# EAGLE design ESP32-S3 Parallel TFT with Touch 4.3“ V1.1 (EAGLE 6.1)
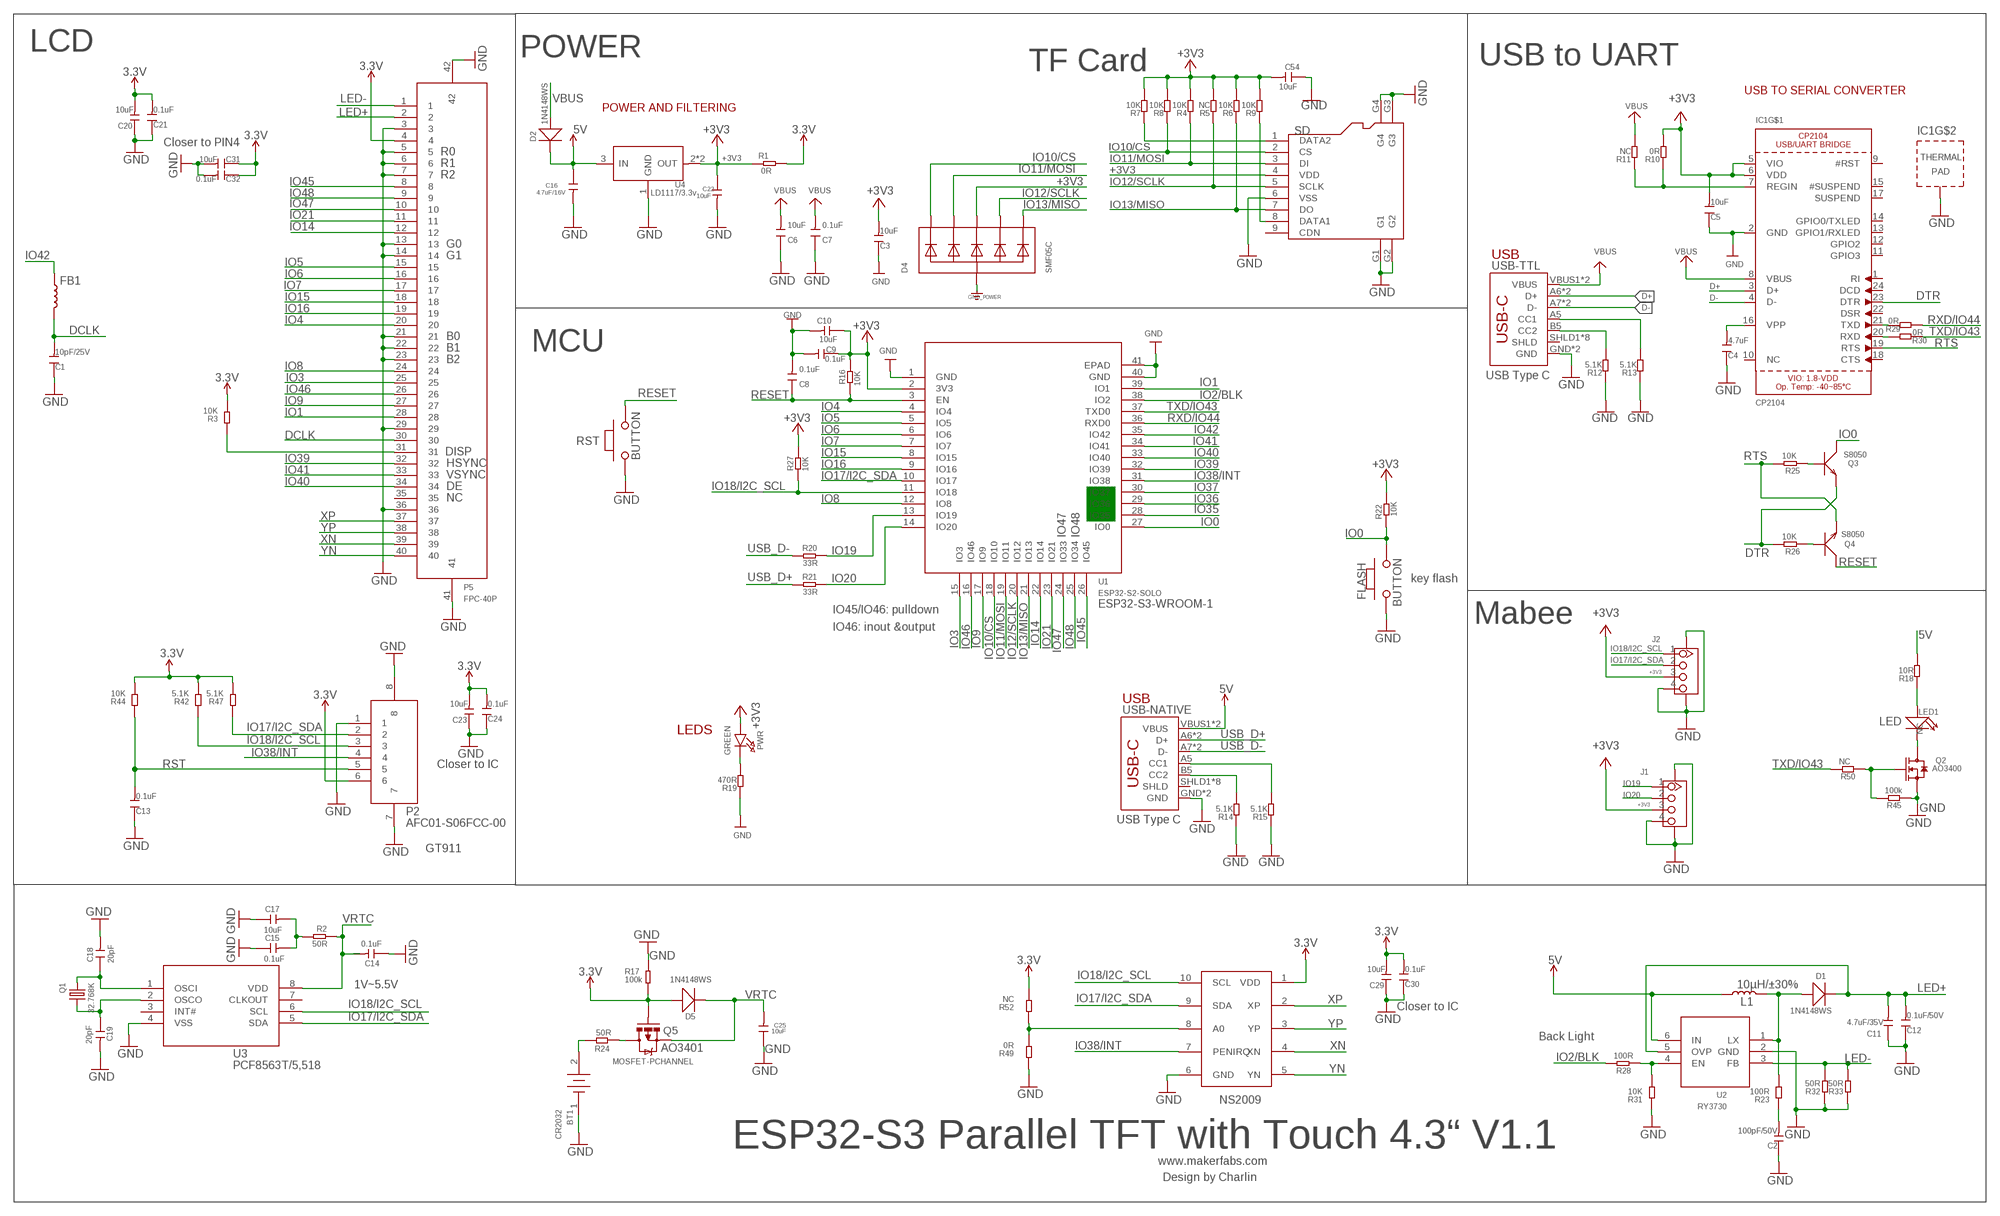
[diagram p0: schematic, sheet 1]

## Parts
BT1  CR2032  [CR2032]
C1  10pF/25V  DISCRETE_C-0603  [DISCRETE_C0603]
C2  100pF/50V  DISCRETE_C-0603  [DISCRETE_C0603]
C3  10uF  DISCRETE_C-0603  [DISCRETE_C0603]
C4  4.7uF  DISCRETE_C-0603  [DISCRETE_C0603]
C5  10uF  DISCRETE_C-0603  [DISCRETE_C0603]
C6  10uF  DISCRETE_C-0603  [DISCRETE_C0603]
C7  0.1uF  DISCRETE_C-0603  [DISCRETE_C0603]
C8  0.1uF  DISCRETE_C-0603  [DISCRETE_C0603]
C9  0.1uF  DISCRETE_C-0603  [DISCRETE_C0603]
C10  10uF  DISCRETE_C-0603  [DISCRETE_C0603]
C11  4.7uF/35V  DISCRETE_C-1206  [DISCRETE_C1206]
C12  0.1uF/50V  DISCRETE_C-0603  [DISCRETE_C0603]
C13  0.1uF  DISCRETE_C-0603  [DISCRETE_C0603]
C14  0.1uF  DISCRETE_C-0603  [DISCRETE_C0603]
C15  0.1uF  DISCRETE_C-0603  [DISCRETE_C0603]
C16  4.7uF/16V  C-0603  [0603]
C17  10uF  DISCRETE_C-0603  [DISCRETE_C0603]
C18  20pF  DISCRETE_C-0603  [DISCRETE_C0603]
C19  20pF  DISCRETE_C-0603  [DISCRETE_C0603]
C20  10uF  DISCRETE_C-0603  [DISCRETE_C0603]
C21  0.1uF  DISCRETE_C-0603  [DISCRETE_C0603]
C22  10uF  C-0603  [0603]
C23  10uF  DISCRETE_C-0603  [DISCRETE_C0603]
C24  0.1uF  DISCRETE_C-0603  [DISCRETE_C0603]
C25  10uF  C-0603  [0603]
C29  10uF  DISCRETE_C-0603  [DISCRETE_C0603]
C30  0.1uF  DISCRETE_C-0603  [DISCRETE_C0603]
C31  10uF  DISCRETE_C-0603  [DISCRETE_C0603]
C32  0.1uF  DISCRETE_C-0603  [DISCRETE_C0603]
C54  10uF  DISCRETE_C-0603  [DISCRETE_C0603]
D1  1N4148WS  D'0805'  [SOD323]
D2  1N4148WS  D'0805'  [SOD323]
D4  SMF05C  TVSARRAY_5LANE  [SOT363]
D5  1N4148WS  D'0805'  [SOD323]
FB1  INDUCTORFB-30OHM  [0603]
FLASH  BUTTON  PB157  [157SW]
IC1  CP2104  [QFN24_4MM_SMSC]
J1  GROVE-CONNECTOR-SMD'90D'  [HW4-SMD-2.0-90D]
J2  GROVE-CONNECTOR-SMD'90D'  [HW4-SMD-2.0-90D]
L1  10µH/±30%  INDUCTOR-CR54-3.3UH  [CR54]
LED1  NC  DISCRETE_LED3528  [DISCRETE_LED-3528]
P2  AFC01-S06FCC-00  [SMD8-50P-740L535W]
P5  FPC-40P  [SMD42-50P-2560L490W]
PWR  GREEN  LED0805_NOOUTLINE  [CHIPLED_0805_NOOUTLINE]
Q1  32.768K  CRYSTAL_3215  [XTAL3215]
Q2  AO3400  MOSFET-N'SOT23'  [SOT23@1]
Q3  S8050  TRANSISTOR-NPN-SOT23  [SOT23]
Q4  S8050  TRANSISTOR-NPN-SOT23  [SOT23]
Q5  MOSFET-PCHANNEL  [SOT23-3]
R1  0R  R-0603  [R0603]
R2  50R  R-0603  [R0603]
R3  10K  DISCRETE_R-0603  [DISCRETE_R0603]
R4  10K  DISCRETE_R-0603  [DISCRETE_R0603]
R5  NC  DISCRETE_R-0603  [DISCRETE_R0603]
R6  10K  DISCRETE_R-0603  [DISCRETE_R0603]
R7  10K  DISCRETE_R-0603  [DISCRETE_R0603]
R8  10K  DISCRETE_R-0603  [DISCRETE_R0603]
R9  10K  DISCRETE_R-0603  [DISCRETE_R0603]
R10  0R  DISCRETE_R-0603  [DISCRETE_R0603]
R11  NC  DISCRETE_R-0603  [DISCRETE_R0603]
R12  5.1K  DISCRETE_R-0603  [DISCRETE_R0603]
R13  5.1K  DISCRETE_R-0603  [DISCRETE_R0603]
R14  5.1K  DISCRETE_R-0603  [DISCRETE_R0603]
R15  5.1K  DISCRETE_R-0603  [DISCRETE_R0603]
R16  10K  R-0603  [R0603]
R17  100k  R-0603  [R0603]
R18  10R  DISCRETE_R-0603  [DISCRETE_R0603]
R19  470R  DISCRETE_R-0603  [DISCRETE_R0603]
R20  33R  R-0603  [R0603]
R21  33R  R-0603  [R0603]
R22  10K  R-0603  [R0603]
R23  100R  DISCRETE_R-0603  [DISCRETE_R0603]
R24  50R  R-0603  [R0603]
R25  10K  R-0603  [R0603]
R26  10K  R-0603  [R0603]
R27  10K  R-0603  [R0603]
R28  100R  DISCRETE_R-0603  [DISCRETE_R0603]
R29  0R  R-0603  [R0603]
R30  0R  R-0603  [R0603]
R31  10K  DISCRETE_R-0603  [DISCRETE_R0603]
R32  50R  DISCRETE_R-0603  [DISCRETE_R0603]
R33  50R  DISCRETE_R-0603  [DISCRETE_R0603]
R42  5.1K  DISCRETE_R-0603  [DISCRETE_R0603]
R44  10K  DISCRETE_R-0603  [DISCRETE_R0603]
R45  100k  R-0603  [R0603]
R47  5.1K  DISCRETE_R-0603  [DISCRETE_R0603]
R49  0R  DISCRETE_R-0603  [DISCRETE_R0603]
R50  NC  R-0603  [R0603]
R52  NC  DISCRETE_R-0603  [DISCRETE_R0603]
RST  BUTTON  PB157  [157SW]
SD  HOLDER-MICROSD-9P  [9P-SMD-W/-RING]
U1  ESP32­S2­SOLO  [ESP32-­S2-­SOLO]
U2  RY3730  [SOT23-6]
U3  PCF8563T/5,518  [SOP8]
U4  LD1117/3.3v  LD1117'SOT89'  [SOT89]
U8  NS2009  [MSOP10]
USB-NATIVE  USB_C5  [USB-C-16P-5]
USB-TTL  USB_C5  [USB-C-16P-5]

## Nets
3.3V: C20.2 C21.2 C23.2 C24.2 C29.2 C30.2 C31.1 C32.1 D5.+ P2.6 P5.4 Q5.1(G) R1.2 R3.2 R17.1 R42.2 R44.2 R47.2 R52.2 U8.1(VDD)
5V: C16.1 D2.- L1.P$1 R18.2 U2.6(IN) U4.3(IN) USB-NATIVE.VBUS1(VBUS) USB-NATIVE.VBUS2(VBUS)
+3V3: C3.2 C5.2 C9.1 C10.1 C22.1 C54.2 D4.4(C3) IC1.5(VIO) IC1.6(VDD) J1.3 J2.3 PWR.A R1.1 R4.2 R5.2 R6.2 R7.2 R8.2 R9.2 R10.2 R16.2 R22.2 R27.2 SD.4(VDD) U1.2(3V3) U4.2(OUT) U4.4(OUT)
D+: IC1.3(D+) USB-TTL.A6(D+) USB-TTL.B6(D+)
D-: IC1.4(D-) USB-TTL.A7(D-) USB-TTL.B7(D-)
DCLK: C1.2 FB1.2 P5.30
DTR: IC1.23(DTR) Q3.2(E) R26.2
GND: BT1.1 C1.1 C2.1 C3.1 C4.1 C5.1 C6.1 C7.1 C8.2 C9.2 C10.2 C11.1 C12.1 C13.1 C14.1 C15.1 C16.2 C17.1 C18.2 C19.2 C20.1 C21.1 C22.2 C23.1 C24.1 C25.1 C29.1 C30.1 C31.2 C32.2 C54.1 D4.2(A) FLASH.1 IC1.2(GND) IC1.THERM(TP) J1.4 J1.SS1 J1.SS2 J2.4 J2.SS1 J2.SS2 P2.1 P2.7 P2.8 P5.3 P5.5 P5.6 P5.7 P5.13 P5.14 P5.21 P5.22 P5.23 P5.29 P5.36 P5.41 P5.42 Q2.2(S) R12.1 R13.1 R14.1 R15.1 R17.2 R19.1 R31.1 R32.1 R33.1 R45.1 R49.1 RST.1 SD.6(VSS) SD.G1 SD.G2 SD.G3 SD.G4 U1.1(GND) U1.40(GND) U1.41(EPAD) U2.2(GND) U3.4(VSS) U4.1(GND) U8.6(GND) USB-NATIVE.GND USB-NATIVE.GND2(GND) USB-TTL.GND USB-TTL.GND2(GND) ; supply symbol labelled GND_POWER
IO0: FLASH.2 Q3.3(C) R22.1 U1.27(IO0)
IO1: P5.28 U1.39(IO1)
IO2/BLK: R28.2 U1.38(IO2)
IO3: P5.25 U1.15(IO3)
IO4: P5.20 U1.4(IO4)
IO5: P5.15 U1.5(IO5)
IO6: P5.16 U1.6(IO6)
IO7: P5.17 U1.7(IO7)
IO8: P5.24 U1.12(IO8)
IO9: P5.27 U1.17(IO9)
IO10/CS: D4.1(C1) R8.1 SD.2(CS) U1.18(IO10)
IO11/MOSI: D4.3(C2) R4.1 SD.3(DI) U1.19(IO11)
IO12/SCLK: D4.5(C4) R5.1 SD.5(SCLK) U1.20(IO12)
IO13/MISO: D4.6(C5) R6.1 SD.7(DO) U1.21(IO13)
IO14: P5.12 U1.22(IO14)
IO15: P5.18 U1.8(IO15)
IO16: P5.19 U1.9(IO16)
IO17/I2C_SDA: J2.2 P2.2 R47.1 U1.10(IO17) U3.5(SDA) U8.9(SDA)
IO18/I2C_SCL: J2.1 P2.3 R27.1 R42.1 U1.11(IO18) U3.6(SCL) U8.10(SCL)
IO19: J1.1 R20.2 U1.13(IO19)
IO20: J1.2 R21.2 U1.14(IO20)
IO21: P5.11 U1.23(IO21)
IO35: U1.28(IO35)
IO36: U1.29(IO36)
IO37: U1.30(IO37)
IO38/INT: P2.4 U1.31(IO38) U8.7(PENIRQ)
IO39: P5.32 U1.32(IO39)
IO40: P5.34 U1.33(IO40)
IO41: P5.33 U1.34(IO41)
IO42: FB1.1 U1.35(IO42)
IO45: P5.8 U1.26(IO45)
IO46: P5.26 U1.16(IO46)
IO47: P5.10 U1.24(IO33)
IO48: P5.9 U1.25(IO34)
LED+: C11.2 C12.2 D1.- P5.2 U2.5(OVP)
LED-: P5.1 R32.2 R33.2 U2.3(FB)
N$1: C4.2 IC1.16(VPP)
N$2: Q4.1(B) R26.1
N$3: Q3.1(B) R25.1
N$4: C18.1 Q1.P$1 U3.1(OSCI)
N$5: Q2.1(G) R45.2 R50.1
N$6: R15.2 USB-NATIVE.A5(CC1)
N$7: PWR.C R19.2
N$8: LED1.1(+) R18.1
N$9: LED1.2(-) Q2.3(D)
N$10: R13.2 USB-TTL.A5(CC1)
N$11: R12.2 USB-TTL.B5(CC2)
N$12: IC1.7(REGIN) R10.1 R11.1
N$13: C19.1 Q1.P$2 U3.2(OSCO)
N$14: R14.2 USB-NATIVE.B5(CC2)
N$15: Q5.3(D) R24.1
N$16: C15.2 C17.2 R2.1
N$17: D1.+ L1.P$2 R23.2 U2.1(LX)
N$18: IC1.21(TXD) R29.2
N$19: IC1.20(RXD) R30.2
N$20: BT1.2 R24.2
N$22: C2.2 R23.1
N$24: R28.1 R31.2 U2.4(EN)
N$25: R49.2 R52.1 U8.8(A0)
N$28: P5.31 R3.1
N$47: R7.1 SD.1(DATA2)
N$48: R9.1 SD.8(DATA1)
RESET: C8.1 Q4.3(C) R16.1 RST.2 U1.3(EN)
RST: C13.2 P2.5 R44.1
RTS: IC1.19(RTS) Q4.2(E) R25.2
RXD/IO44: R29.1 U1.36(RXD0)
TXD/IO43: R30.1 R50.2 U1.37(TXD0)
USB_D+: R21.1 USB-NATIVE.A6(D+) USB-NATIVE.B6(D+)
USB_D-: R20.1 USB-NATIVE.A7(D-) USB-NATIVE.B7(D-)
VBUS: C6.2 C7.2 D2.+ IC1.8(VBUS) R11.2 USB-TTL.VBUS1(VBUS) USB-TTL.VBUS2(VBUS)
VRTC: C14.2 C25.2 D5.- Q5.2(S) R2.2 U3.8(VDD)
XN: P5.39 U8.4(XN)
XP: P5.37 U8.2(XP)
YN: P5.40 U8.5(YN)
YP: P5.38 U8.3(YP)
Unconnected: IC1.1(RI) IC1.9(#RST) IC1.10(NC) IC1.11(GPIO3) IC1.12(GPIO2) IC1.13(GPIO1/RXLED) IC1.14(GPIO0/TXLED) IC1.15(#SUSPEND) IC1.17(SUSPEND) IC1.18(CTS) IC1.22(DSR) IC1.24(DCD) P5.35 SD.9(CDN) U3.3(INT#) U3.7(CLKOUT) USB-NATIVE.SHLD1(SHLD) USB-NATIVE.SHLD2(SHLD) USB-NATIVE.SHLD3(SHLD) USB-NATIVE.SHLD4(SHLD) USB-NATIVE.SHLD5(SHLD) USB-NATIVE.SHLD6(SHLD) USB-NATIVE.SHLD7(SHLD) USB-NATIVE.SHLD8(SHLD) USB-TTL.SHLD1(SHLD) USB-TTL.SHLD2(SHLD) USB-TTL.SHLD3(SHLD) USB-TTL.SHLD4(SHLD) USB-TTL.SHLD5(SHLD) USB-TTL.SHLD6(SHLD) USB-TTL.SHLD7(SHLD) USB-TTL.SHLD8(SHLD)

## Notes on the sheet
- LCD | POWER
- TF Card | USB to UART
- USB TO SERIAL CONVERTER
- POWER AND FILTERING
- Closer to PIN4
- R0
- R1
- R2
- G0
- G1 | USB
- B0
- B1 | MCU
- B2
- USB Type C
- DISP
- HSYNC
- VSYNC
- DE
- NC
- IO47 | IO48
- key flash
- ESP32-S3-WROOM-1
- IO45/IO46: pulldown
- Mabee
- IO46: inout &output
- USB
- LED
- LEDS
- Closer to IC
- USB Type C
- GT911
- 1V~5.5V
- Closer to IC
- Back Light
- AO3401
- NS2009
- ESP32-S3 Parallel TFT with Touch 4.3“ V1.1
- www.makerfabs.com
- Design by Charlin

## Library data of the parts
BT1 = sale:CR2032
C1-C15 C17-C21 C23 C24 C29-C32 C54 = A9G:DISCRETE_C*: Ceramic Capacitors
C16 C22 C25 = Discrete:C*: Ceramic Capacitors
D1 D2 D5 = Discrete:D*
D4 = microbuilder:TVSARRAY_5LANE: Voltage Transient Suppressor Array SOT363 SMF05C - 100W 5V: Digikey - SMF05CT1GOSCT-ND
FB1 = SparkFun-Coils:INDUCTOR: Inductors Resist changes in electrical current. Basically a coil of wire. SparkFun Products: SparkFun Load Cell Amplifier - HX711 <https://www.sparkfun.com/products/13879> IOIO-OTG - V2.2 <https://www.sparkfun.com/products/13613>; PROD_ID: NDUC-07859
FLASH RST = MySMD:PB157
IC1 = microbuilder:CP2104: CP2104 - USB to UART Bridge VDD Output: 3.45V
J1 J2 = Connector-new:GROVE-CONNECTOR-SMD: 4P-SMD-2.0:320110030;4P-SMD-2.0-90D:320110032
L1 = SparkFun-Coils:INDUCTOR: Inductors Resist changes in electrical current. Basically a coil of wire. SparkFun Products: SparkFun Load Cell Amplifier - HX711 <https://www.sparkfun.com/products/13879> IOIO-OTG - V2.2 <https://www.sparkfun.com/products/13613>; PROD_ID: NDUC-11157; VALUE: 3.3µH/±30%/3.4A
LED1 = Relay:DISCRETE_LED*
P2 = self:AFC01-S06FCC-00
P5 = self:FPC-40P
PWR = microbuilder:LED: LED 0603 - 0603 Surface Mount Package 2mA: Green LED - Low Power (3.9mcd, 2ma, 1.7Vf) - Digikey: 475-2709-2-ND Orange LED - Low Power (9.8mcd, 2ma, 1.8Vf) - Digikey: 475-1194-2-ND Red LED - Low Power (5mcd, 2ma, 1.8Vf) - Digikey: 475-1195-2-ND Yellow LED - Low Power (7mcd, 2ma, 1.8Vf) - Digikey: 475-1196-2-ND 5mA: Blue LED - Low Power (17mcd, 5ma, 2.9Vf) - Digikey: LNJ937W8CRACT-ND 0805 - 0805 Surface Mount Package 2mA: Red LED (8.8mcd, 2mA, 1.8Vf, Clear) - Low Power [Digikey: 475-2510-1-ND] Green LED (5mcd, 2mA, 1.8Vf, Clear) - Low Power [Digikey: 475-2730-1-ND] Yellow LED (11.3mcd, 2mA, 1.8Vf, Clear) - Low Power [Digikey: 475-2555-1-ND] 20mA: Red LED (104mcd, 20mA, Diffused) - LS R976 [Digikey: 475-1278-6-ND] Red LED (12mcd, 20mA, 2.0Vf, Clear) - APT2012EC [Digikey: 754-1128-1-ND] Green LED (15mcd, 20mA, 2.2Vf, Clear) - APT2012GC [Digikey: 754-1131-1-ND] Orange LED (160mcd, 20mA, 2.1Vf, Clear) - APT2012SECK [Digikey: 754-1130-1-ND] 1206 - 1206 Surface Mount Package Green LED (26mcd, 20mA, Diffused) - LG N971 [Digikey: 475-1407-6-ND] Red LED (15mcd, 20mA, Diffused) - LH N974 [Digikey: 475-1416-6-ND] Cree - Cree High-Power Surface Mount LEDs XPEBWT-L1-0000-00D50 - White 111lm 350mA 2.9Vf 6200K 110° XTEAWT-00-0000-00000LEE3 - White 114lm 350mA 2.85Vf 5000K 115° Everlight - Everlight 45-21 Series Surface Mount LEDs 45-21/QK2C-B2832AC2CB2/2T - Warm White 2000mcd 20mA 3.25Vf 3050K 120° 45-21/LK2C-B38452C4CB2/2T - Nuetral White 2000mcd 20mA 3.25Vf 4150K 120° 45-21/LK2C-B50634C6CB2/2T - Cold White 2200mcd 20mA 3.25Vf 5650K 120° PLCC2 Reverse Mount LS T77K-J1L2-1-0-2-R18-Z - Red 11.25mcd 2mA 1.8Vf 630nm 120° LO T77K-L1M2-24-Z - Orange 19.6mcd 2mA 1.8Vf 606nm 120° LY T77K-K2M1-26-Z - Yellow 15.7mcd 2mA 1.8Vf 587nm 120°
Q1 = microbuilder:CRYSTAL: Crystals HC49UP - Surface Mount Crystal 4.0MHz 18pF +/-30ppm Surface Mount Crystal [Digikey: 535-9857-1-ND] 12.0 MHz Surface Mount Crystal [Digikey: 535-9869-6-ND] 25.0 MHz Surface Mount Crystal [Digikey: 535-9078-1-ND] 2.5 x 2.0mm - MEMs SMT Crystal 16.0 MHz 10pF 20ppm 2.5 x 2.0mm Crystal [Digikey -40-85°C: 535-10923-1-ND] 3.2 x 2.5mm - MEMs SMT Crystal 12.0 MHz 8pF 15ppm 3.2 x 2.5mm Crystal [Digikey: -10-70°C: 644-1047-1-ND -40-125°C: 644-1128-1-ND] 40~85°C cheaper: 644-1173-6-ND 16.0 MHz 8pF 15ppm 3.2 x 2.5mm Crystal [Digikey: -10-70°C: 644-1049-1-ND -40-125°C: 644-1129-2-ND]-40~85°C cheaper: 644-1175-6-ND 16.0 MHz 10pF 10ppm 3.2 x 2.5mm Crystal [Digikey: 644-1100-1-ND] 27.12 MHz 18pF 30ppm 3.2 x 2.5mm Crystal [Digikey: 887-1424-1-ND] 27.12MHz 10pF 10ppm 3.2 x 2.5mm Crystal [Digikey: 887-1329-1-ND] 4.9 x 1.8mm - MEMs SMT Crystal 32.768 KHz 12.5pF 20ppm 4.9 x 1.8mm Crystal [Digikey: SE2415CT-ND] 8.0 x 3.8mm - Surface Mount Crystal 32.768kHz 12.5pF 20ppm -40°C-85°C [Digikey: 535-9166-2-ND] Cylinder 32.768KHz Cylinder Crystal (2x6mm body) [Ex. Digikey: 300-8341-2-ND]
Q2 = Discrete:MOSFET-N: IRLL014: http://www.vishay.com/docs/91319/sihll014.pdf
Q3 Q4 = Discrete:TRANSISTOR-NPN*: NPN audion
Q5 = User-Submitted:MOSFET-PCHANNEL: Generic PMOSFET IRLML2244 - TRANS-11153 (SOT-23 -20V -4.3A) (1.Gate 2.Source 3.Drain) FQP27P06 - COM-10349 <http://www.sparkfun.com/products/10349> (TO-220 -60V -27A) (1.Gate 2.Source 3.Drain); PROD_ID: TRANS-08285
R1 R2 R16 R17 R20-R22 R24-R27 R29 R30 R45 R50 = Discrete:R*
R3-R15 R18 R19 R23 R28 R31-R33 R42 R44 R47 R49 R52 = A9G:DISCRETE_R*
SD = Connector:HOLDER-MICROSD-9P
U1 = self:ESP32­S2­SOLO
U2 = sale:RY3730
U3 = sale:PCF8563T/5,518
U4 = IC:LD1117: Low Drop Fixed And Adjustable Positive Voltage Regulators http://www.datasheetcatalog.org/datasheet/SGSThomsonMicroelectronics/mXuqtqv.pdf
U8 = NS2009:NS2009
USB-NATIVE USB-TTL = USBC:USB_C: USB Type C 16Pin Connector Super Speed pins not available on the 16-pin purely SMD connector so this part is best for USB 2.0 implementations. D1 and D2 are tied together enabling D+/- no matter which way the cable is plugged into the connector. The two channel configuration pins (CC1/2) are exposed. These are normally connected to ground via 5.1k resistors but can be reconfigured for high current/high power applications.

## Net classes
0 default: width 0.203 mm, drill 0.305 mm, clearance 0.152 mm
1 vbat: width 0.254 mm, drill 0.305 mm, clearance 0.152 mm

## Board
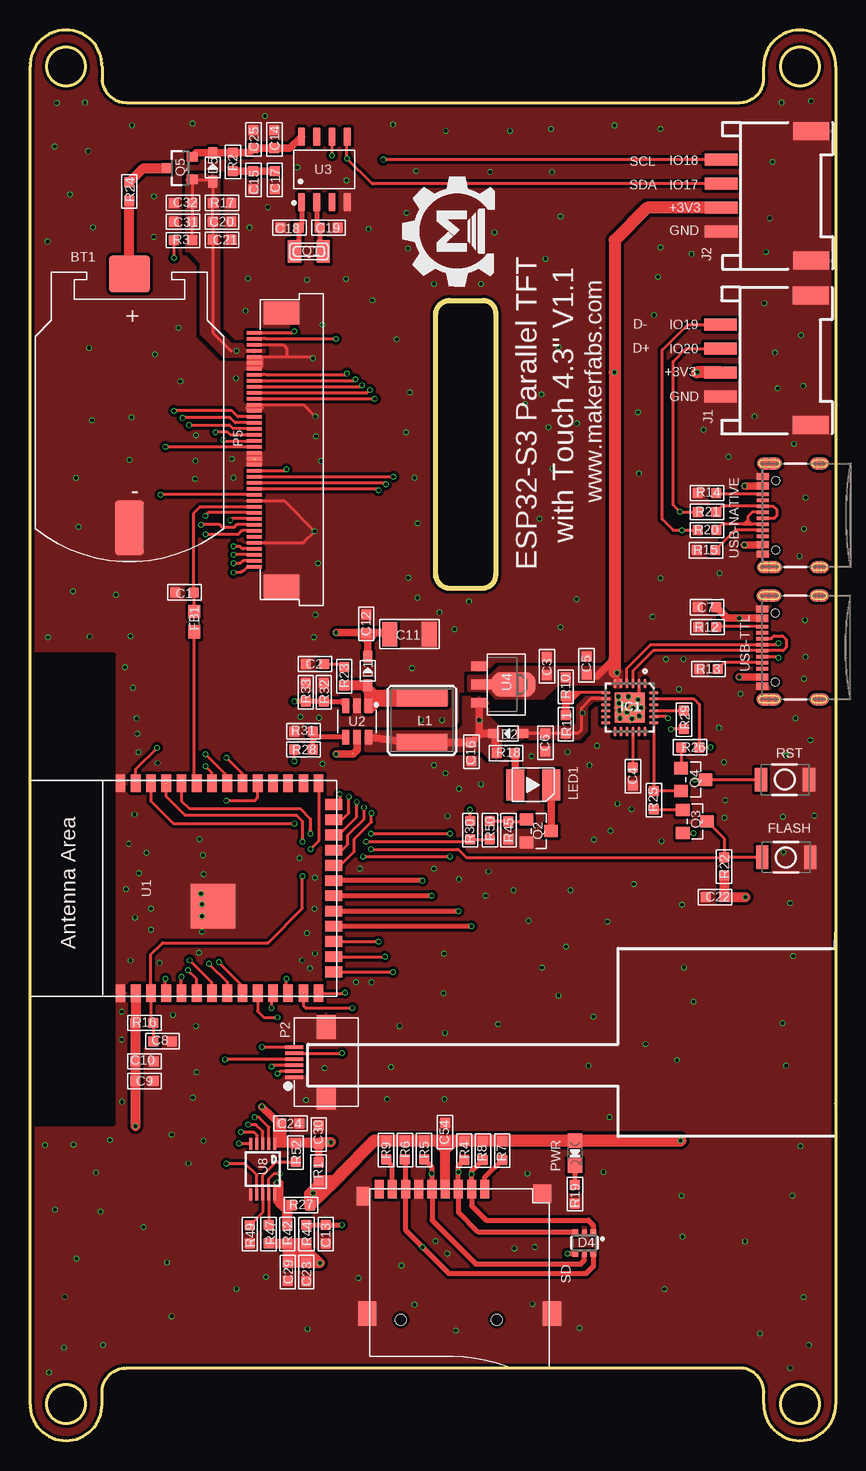
[diagram p1: board, top side]
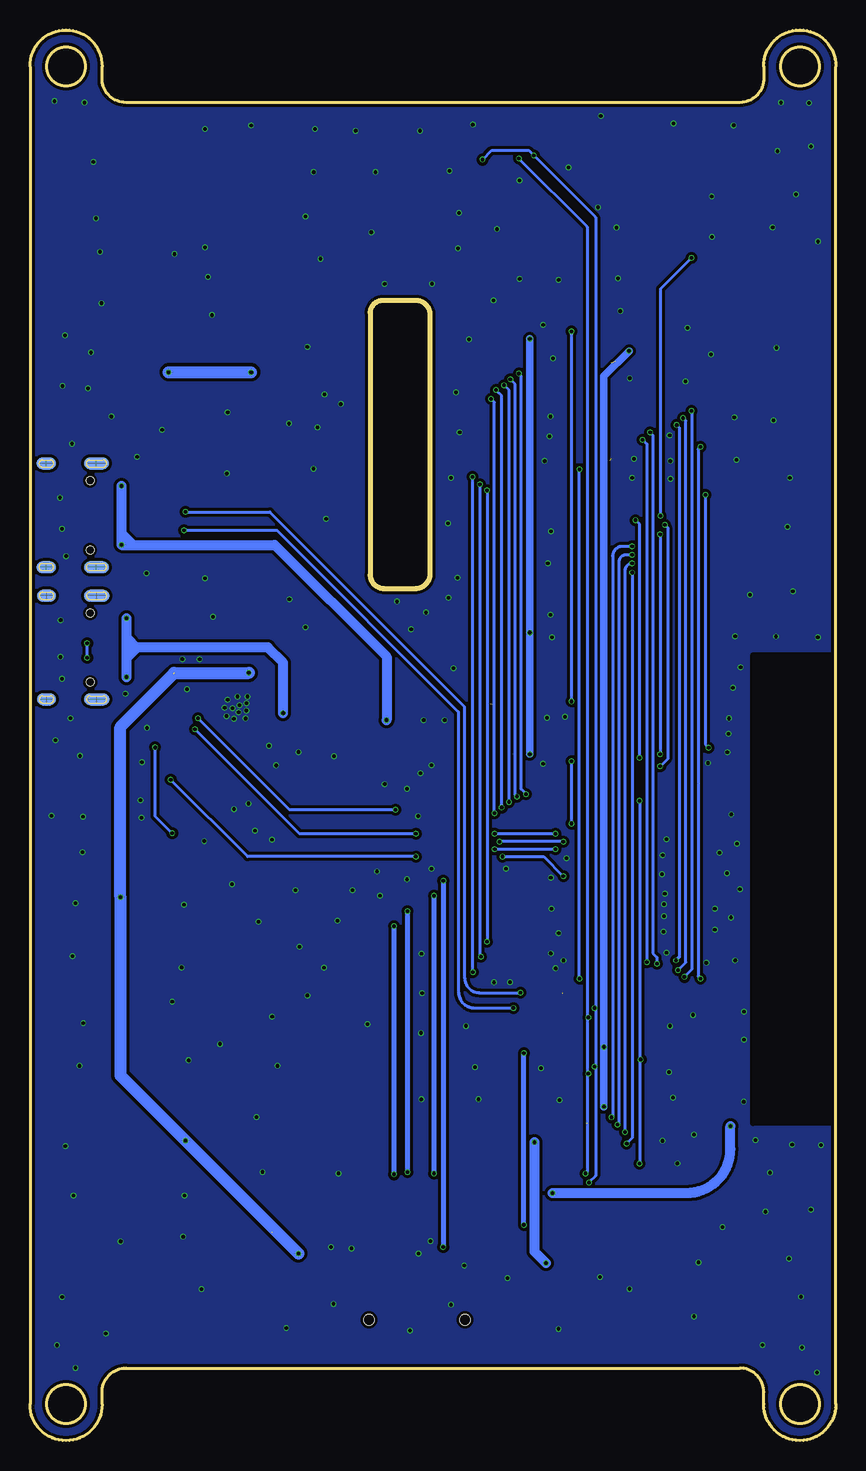
[diagram p2: board, bottom side, seen from below]

Size 67.15 x 117.6 mm. Coordinates in mm from the lower left corner, seen from the top.
Outline: 61.15,3.05 61.15,4.05 arc90 59.15,6.05 8,6.05 arc90 6,4.05 6,3.05 arc-182 0,3.05 0,114.55 arc-182 6,114.55 6,113.55 arc90 8,111.55 59.15,111.55 arc90 61.15,113.55 61.15,114.55 arc-182 67.15,114.55 67.15,3.05 arc-182 61.15,3.05
Outline: 38.81,94.01 38.81,72.18 arc-90 37.67,71.05 35,71.05 arc-90 33.81,72.24 33.81,93.87 arc-90 34.98,95.05 37.77,95.05 arc-90 38.81,94.01
Outline: circle at 3,114.55 radius 1.6
Outline: circle at 3,3.05 radius 1.6
Outline: circle at 64.15,3.05 radius 1.6
Outline: circle at 64.15,114.55 radius 1.6
Copper layers (1*16): Top 0.035mm / dielectric 1.5mm / Bottom 0.035mm
Design rules: minimum track width 6mil, minimum drill 10mil, track to track 6mil, track to pad 6mil, pad to pad 6mil, via to via 6mil, smd to smd 0mil, copper to edge 10mil, drill to drill 10mil, minimum pad ring 3mil, minimum via ring 3mil, stop-mask expansion 2mil, vias tented up to drill 100mil, thermal gap 0mil
tRestrict: area 0.1,26.5 to 6.9,65.5
bRestrict: area 0.1,26.5 to 6.9,65.5

### Footprints (pad centres in the part's own frame; a part is rotated, then mirrored left to right if it is on the bottom)
CR2032 = smd 4.5 x 2.4: 1 -10.95,0 | smd 3.05 x 3.4: 2 10.225,0
DISCRETE_C0603 = smd 0.889 x 0.889: 1 -0.762,0; 2 0.762,0
DISCRETE_C1206 = smd 1.27 x 2.032: 1 -1.651,0; 2 1.651,0
0603 = smd 0.889 x 0.889: 1 -0.762,0; 2 0.762,0
SOD323 = smd 1 x 0.8: + -1.2,0; - 1.2,0
SOT363 = smd 0.5 x 0.5: 1 -0.75,-0.9; 3 0.75,-0.9; 4 0.75,0.9; 6 -0.75,0.9 | smd 0.4 x 0.5: 2 0,-0.9; 5 0,0.9
0603' = smd 1.1 x 1: 1 -0.85,0; 2 0.85,0
157SW = smd 1.016 x 1.981: 1 0,0; 2 4,0
QFN24_4MM_SMSC = smd 0.8 x 0.28: 1 -2,1.25; 2 -2,0.75; 3 -2,0.25; 4 -2,-0.25; 5 -2,-0.75; 6 -2,-1.25; 13 2,-1.25; 14 2,-0.75; 15 2,-0.25; 16 2,0.25; 17 2,0.75; 18 2,1.25 | smd 0.28 x 0.8: 7 -1.25,-2; 8 -0.75,-2; 9 -0.25,-2; 10 0.25,-2; 11 0.75,-2; 12 1.25,-2; 19 1.25,2; 20 0.75,2; 21 0.25,2; 22 -0.25,2; 23 -0.75,2; 24 -1.25,2 | smd 2.5 x 2.5: THERM 0,0
HW4-SMD-2.0-90D = smd 1.01 x 2.74: 1 -3,-0.1; 2 -1,-0.1; 3 1,-0.1; 4 3,-0.1 | smd 1.5 x 3: SS1 -5.4,7.4; SS2 5.4,7.4
CR54 = smd 4.2 x 1.4: P$1 0,1.85; P$2 0,-1.85
DISCRETE_LED-3528 = smd 1.5 x 2.6: 1 -1.5,0; 2 1.5,0
SMD8-50P-740L535W = smd 0.3 x 1.5: 1 -1.25,0; 2 -0.75,0; 3 -0.25,0; 4 0.25,0; 5 0.75,0; 6 1.25,0 | smd 2 x 1.6: 7 2.95,-2.68; 8 -2.95,-2.68
SMD42-50P-2560L490W = smd 0.3 x 1.3: 1 9.75,0; 2 9.25,0; 3 8.75,0; 4 8.25,0; 5 7.75,0; 6 7.25,0; 7 6.75,0; 8 6.25,0; 9 5.75,0; 10 5.25,0; 11 4.75,0; 12 4.25,0; 13 3.75,0; 14 3.25,0; 15 2.75,0; 16 2.25,0; 17 1.75,0; 18 1.25,0; 19 0.75,0; 20 0.25,0; 21 -0.25,0; 22 -0.75,0; 23 -1.25,0; 24 -1.75,0; 25 -2.25,0; 26 -2.75,0; 27 -3.25,0; 28 -3.75,0; 29 -4.25,0; 30 -4.75,0; 31 -5.25,0; 32 -5.75,0; 33 -6.25,0; 34 -6.75,0; 35 -7.25,0; 36 -7.75,0; 37 -8.25,0; 38 -8.75,0; 39 -9.25,0; 40 -9.75,0 | smd 2 x 3: 41 -11.4,-2.25; 42 11.4,-2.25
CHIPLED_0805_NOOUTLINE = smd 1.2 x 1.2: A 0,-1.05; C 0,1.05
XTAL3215 = smd 1.1 x 1.9: P$1 1.2,0; P$2 -1.2,0
SOT23@1 = smd 1.016 x 1.143: 1 -0.95,-1.016; 2 0.95,-1.016; 3 0,1.016
SOT23 = smd 1.016 x 1.143: 1 -0.95,-1.016; 2 0.95,-1.016; 3 0,1.016
SOT23-3 = smd 0.8 x 0.9: 1 -0.95,-1; 2 0.95,-1; 3 0,1.1
R0603 = smd 0.889 x 0.889: 1 -0.762,0; 2 0.762,0
DISCRETE_R0603 = smd 0.889 x 0.889: 1 -0.762,0; 2 0.762,0
9P-SMD-W/-RING = smd 1.524 x 0.762: 1 0,4.4; 2 0,3.3; 3 0,2.2; 4 0,1.1; 5 0,0; 6 0,-1.1; 7 0,-2.2; 8 0,-3.3; 9 0,-4.4 | smd 1.524 x 1.016: G1 0.6,-5.746 | smd 2.032 x 1.524: G2 10.373,-5.4; G3 10.373,10 | smd 1.524 x 1.524: G4 0.392,9.181 | hole 0.889: 10.9,-2.6; 10.9,5.4
ESP32-­S2-­SOLO = smd 1.5 x 0.9: 1 -8.75,5.26; 2 -8.75,3.99; 3 -8.75,2.72; 4 -8.75,1.45; 5 -8.75,0.18; 6 -8.75,-1.09; 7 -8.75,-2.36; 8 -8.75,-3.63; 9 -8.75,-4.9; 10 -8.75,-6.17; 11 -8.75,-7.44; 12 -8.75,-8.71; 13 -8.75,-9.98; 14 -8.75,-11.25; 27 8.75,-11.25; 28 8.75,-9.98; 29 8.75,-8.71; 30 8.75,-7.44; 31 8.75,-6.17; 32 8.75,-4.9; 33 8.75,-3.63; 34 8.75,-2.36; 35 8.75,-1.09; 36 8.75,0.18; 37 8.75,1.45; 38 8.75,2.72; 39 8.75,3.99; 40 8.75,5.26 | smd 0.9 x 1.5: 15 -6.985,-12.5; 16 -5.715,-12.5; 17 -4.445,-12.5; 18 -3.175,-12.5; 19 -1.905,-12.5; 20 -0.635,-12.5; 21 0.635,-12.5; 22 1.905,-12.5; 23 3.175,-12.5; 24 4.445,-12.5; 25 5.715,-12.5; 26 6.985,-12.5 | smd 3.7 x 3.7: 41 -1.5,-2.46
SOT23-6 = smd 1.2 x 0.6: 1 -1.3,0.95; 2 -1.3,0; 3 -1.3,-0.95; 4 1.3,-0.95; 5 1.3,0; 6 1.3,0.95
SOP8 = smd 1.52 x 0.6: 1 -2.74,1.905; 2 -2.74,0.635; 3 -2.74,-0.635; 4 -2.74,-1.905; 5 2.74,-1.905; 6 2.74,-0.635; 7 2.74,0.635; 8 2.74,1.905
SOT89 = smd 0.8 x 1.4: 1 -1.524,-1.905; 3 1.524,-1.905 | smd 0.8 x 1.9: 2 0,-1.651 | smd 2.032 x 3.65: 4 0,0.94
MSOP10 = smd 0.25 x 1: 1 -1,-2.113; 2 -0.5,-2.113; 3 0,-2.113; 4 0.5,-2.113; 5 1,-2.113; 6 1,2.113; 7 0.5,2.113; 8 0,2.113; 9 -0.5,2.113; 10 -1,2.113
USB-C-16P-5 = smd 0.3 x 1: A5 -1.25,-0.34; A6 -0.25,-0.34; A7 0.25,-0.34; A8 1.25,-0.34; B5 1.75,-0.34; B6 0.75,-0.34; B7 -0.75,-0.34; B8 -1.75,-0.34 | smd 0.6 x 1: GND -3.225,-0.34; GND2 3.225,-0.34; VBUS1 -2.45,-0.34; VBUS2 2.45,-0.34 | smd 1 x 2.1: SHLD1 -4.32,-0.915; SHLD2 4.32,-0.915 | smd 1 x 2.1 bottom: SHLD3 -4.32,-0.915; SHLD4 4.32,-0.915 | smd 1 x 1.6: SHLD5 -4.32,-5.095; SHLD8 4.32,-5.095 | smd 1 x 1.6 bottom: SHLD6 -4.32,-5.095; SHLD7 4.32,-5.095 | hole 0.65: -2.89,-1.445; 2.89,-1.445

### Placement (x,y rotation side)
BT1  8.28,87.05 90 top
C1  12.88,70.72 0 top
C2  23.75,64.75 0 top
C3  43.08,64.57 270 top
C4  50.24,55.37 90 top
C5  46.38,64.62 270 top
C6  42.95,58.19 90 top
C7  56.41,69.47 0 top
C8  11.05,33.3 0 top
C9  9.55,29.97 0 top
C10  9.55,31.63 0 top
C11  31.62,67.24 180 top
C12  28.02,68.1 270 top
C13  24.64,17.22 90 top
C14  20.37,108.49 270 top
C15  18.62,105.08 90 top
C16  36.78,57.43 270 top
C17  20.4,105.08 90 top
C18  21.62,101.12 180 top
C19  24.89,101.12 0 top
C20  16,101.62 180 top
C21  16,100.1 180 top
C22  57.08,45.31 180 top
C23  23.03,14.04 90 top
C24  21.69,26.45 180 top
C25  18.62,108.49 270 top
C29  21.47,14.07 90 top
C30  24.06,25.52 270 top
C31  12.75,101.61 180 top
C32  12.75,103.17 180 top
C54  34.59,25.71 270 top
D1  28.14,64.16 90 top
D2  39.83,58.96 180 top
D4  46.21,16.48 180 top
D5  15.24,106.15 90 top
FB1  [0603']  13.69,68.28 90 top
FLASH  65.02,48.63 180 top
IC1  49.99,61.1 270 top
J1  57.65,90.05 270 top
J2  57.7,103.78 270 top
L1  32.66,60.05 180 top
LED1  41.92,54.66 0 top
P2  22,31.55 90 top
P5  18.7,82.6 90 top
PWR  45.41,23.97 180 top
Q1  23.24,99.14 180 top
Q2  42.4,50.83 270 top
Q3  55.41,51.62 270 top
Q4  55.28,55.1 270 top
Q5  12.52,106.07 90 top
R1  24.05,22.44 90 top
R2  16.92,106.61 90 top
R3  12.75,100.08 0 top
R4  36.2,24.18 90 top
R5  32.84,24.21 90 top
R6  31.24,24.21 90 top
R7  39.34,24.18 90 top
R8  37.74,24.18 90 top
R9  29.67,24.21 90 top
R10  44.65,62.84 90 top
R11  44.65,59.72 270 top
R12  56.44,67.82 0 top
R13  56.54,64.32 0 top
R14  56.41,79 0 top
R15  56.34,74.22 0 top
R16  9.53,34.83 180 top
R17  16,103.18 0 top
R18  39.65,57.31 180 top
R19  45.42,20.55 90 top
R20  56.41,75.9 180 top
R21  56.41,77.42 180 top
R22  57.84,47.86 270 top
R23  26.19,63.73 270 top
R24  8.28,104.14 270 top
R25  52,53.39 90 top
R26  55.02,57.8 0 top
R27  22.58,19.64 0 top
R28  22.78,57.61 180 top
R29  54.5,60.09 90 top
R30  36.69,50.88 90 top
R31  22.78,59.13 0 top
R32  24.49,62.39 270 top
R33  22.99,62.39 270 top
R42  21.45,17.23 270 top
R44  23.04,17.23 270 top
R45  39.87,50.87 90 top
R47  19.88,17.23 270 top
R49  18.32,17.21 90 top
R50  38.33,50.88 270 top
R52  22.13,24 90 top
RST  64.92,55.1 180 top
SD  33.5,20.98 270 top
U1  12.8,46.05 90 top
U2  27.25,59.95 270 top
U3  24.54,105.97 90 top
U4  39.35,63.03 270 top
U8  19.4,22.65 180 top
U$1  [MAKERFABS_0.3]  38.65,96.71 90 top
USB-NATIVE  60.7,77.14 90 top
USB-TTL  60.68,66.11 90 top

### Tracks (layer width: path | path; a pad name or v marks a point on that pad's centre or on a via)
3.3V  (via drill 0.3)  (1 unrouted)
  Top 0.254: C21.2 C20.2 R17.1 D5.+ 15.07,105.12 Q5.1 13.52,103.18 C32.1 C31.1 R3.2 | C21.2 | C21.2 15.24,92.38 16.79,90.83 | P2.6 19.35,32.8 v19.33,32.82 | 20.4,26.68 20.45,26.72 | R52.2 | U8.1 20.4,26.77 20.1,27.07
  Top 0.61: C24.2 20.72,26.45 20.45,26.72 20.1,27.07 v19.33,27.84 | R1.2 24.05,24.75 C30.2 R52.2 | R52.2 | R52.2 20.6,24.76 20.6,26.39 20.68,26.47 20.75,26.47 21.06,26.17 21.06,25.33 21.41,24.97 24.26,24.97
  Top 0.813: R47.2 R42.2 | R42.2 21.45,14.86 C29.2 21.5,14.81 C23.2 v24.15,14.81 v24.16,14.81 | R44.2 R42.2 | v25.09,24.87 24.17,24.87 C30.2 | 23.04,16.39 23.04,15.93 v24.16,14.81 | v24.16,14.81 23.34,14.81 22.15,16.01 22.15,15.09
  Bottom 0.61: v19.33,27.84 v19.33,32.82 19.33,88.73 v17.22,90.83
  Bottom 0.813: v24.16,14.81 25.09,15.75 v25.09,24.87
  pour Top: 13.08,105.51 15.72,105.51 15.72,92.46 16.79,91.39 17.68,91.39 18.08,90.99 19.5,90.99 19.5,90.71 18.29,90.71 17.96,90.38 16.13,90.38 14.27,92.23 14.27,98.17 13.31,99.14 13.08,99.14
5V  (via drill 0.3)
  Top 0.254: 59.55,79.59 v59.54,79.58 | 61.03,74.68 USB-NATIVE.VBUS1
  Top 0.61: USB-NATIVE.VBUS2 59.55,79.59 | v59.54,74.68 61.03,74.68 | U2.6 32.55,58.09 L1.P$1 C16.1 | R18.2 38.79,57.41 38.79,58.8 D2.- 37.55,58.96 C16.1 | U4.3 v37.45,60.08 v37.44,60.07 37.44,58.85 C16.1
  Bottom 0.61: 58.4,74.63 59.54,75.77
  Bottom 0.813: v59.54,79.58 59.54,75.77 v59.54,74.68 46.76,74.68 37.44,65.36 v37.44,60.07
  pour Top: 27.99,59.13 35.64,59.13 36.14,59.64 36.14,61.98 38.13,61.98 38.13,60.45 39.22,59.36 39.22,56.87 38.3,56.87 37.67,57.51 27.99,57.51
+3V3  (via drill 0.3)  (1 unrouted)
  Top 0.254: IC1.5 IC1.6 | 57.54,89.06 J1.3 | 49,63.63 49,63.1
  Top 0.305: PWR.A v54.19,25.02 v54.2,25.02
  Top 0.406: D4.4 44.8,15.58 v44.78,15.6
  Top 0.61: 48.72,65.21 47.27,63.76
  Top 0.813: U1.2 8.81,34.88 R16.2 8.76,31.65 C10.1 C9.1 v8.79,26.22 | R22.2 C22.1 v59.61,45.31 v59.61,45.32 | SD.4 34.6,24.94 C54.2 | 28.96,25.02 29.01,24.97 R9.2 R6.2 R5.2 34.56,24.97 C54.2 | C54.2 R4.2 R8.2 R7.2 | 50.77,25.02 v54.2,25.02 | R1.1 24.05,20.34 23.93,20.22 | v23.6,20.65 23.6,19.89 R27.2 | 25.88,22.18 25.4,21.69 24.08,21.69 24.08,21.42 23.24,20.58 23.24,19.54 | 33.76,25.02 34.59,24.18 35.46,25.05 35.94,25.05
  Top 1.016: J2.3 51.41,102.78 48.72,100.08 v48.72,89.06 48.72,65.21 48.72,64.05 | 57.54,89.06 v55.6,89.06 | R27.2 23.93,20.22 25.88,22.18 28.73,25.02 28.96,25.02 33.76,25.02 v54.2,25.02
  Bottom 0.305: 59.61,30.43 v54.2,25.02
  Bottom 0.813: v23.6,20.65 12.43,20.65 arc-90 8.79,24.29 v8.79,26.22
  Bottom 1.016: 55.19,63.91 59.61,59.49 v59.61,45.32 59.61,30.43 v44.78,15.6 | 55.14,64.01 v48.92,64.01 | v55.6,89.06 v48.72,89.06
  pour Top: 49.38,62.82 49.38,64.09 49.02,64.44 39.07,64.44 38.33,63.71 36.53,63.71 36.53,62.54 38.18,62.54 38.81,61.9 42.82,61.9 43.51,62.59 43.99,63.07 48.34,63.07 48.44,63.07 48.69,62.82
D+
  Top 0.254: IC1.3 50.24,64.16 51.94,65.86 USB-TTL.A6 62.76,65.87 63.02,66.12 63.02,66.78 62.71,67.08 62,67.08 61.78,66.86 USB-TTL.B6
D-  (via drill 0.3)
  Top 0.254: IC1.4 49.74,64.38 51.71,66.35 61,66.35 USB-TTL.A7 61.03,66.37 62.28,66.37 v62.38,66.48 | USB-TTL.B7 62.27,65.36 v62.38,65.26
  Bottom 0.254: v62.38,65.26 v62.38,66.48
DCLK
  Top 0.254: P5.30 18.16,77.85 14.17,77.85 13.64,77.32 C1.2 13.64,69.18 FB1.2
DTR  (via drill 0.3)
  Top 0.254: IC1.23 55.3,61.85 55.78,61.37 R26.2 v56.72,57.79 | Q3.2 54.44,50.63 v55.3,50.63
  Bottom 0.254: v55.3,50.63 56.72,52.05 v56.72,57.79
GND  (via drill 0.3)  (2 unrouted)
  Top 0.254: IC1.2 50.74,61.82 v50.67,61.75 | P5.5 21.39,90.35 | 21.39,90.35 23.45,90.35 v23.57,90.22 | P5.3 21.15,91.35 21.41,91.09 21.41,90.37 21.39,90.35 | v23.77,85.37 22.8,86.35 P5.13 18.43,86.08 | P5.29 21.17,78.35 v23.72,75.8 22.77,74.85 P5.36 | 18.16,82.38 19.23,82.38 19.23,81.33 18.19,81.33 18.19,82.2 19,82.2 19,81.51 18.39,81.51 18.39,82.02 18.8,82.02 18.8,81.72 18.52,81.72 18.52,82.12 | 18.43,86.08 19.38,86.08 | 18.03,86.08 18.43,86.08 | 19.3,90.35 19.3,89.51 18.19,89.51 18.19,90.2 19.13,90.2 19.13,89.69 18.39,89.69 18.39,90 19.1,90
  other vias: 54.08,62.64 49.02,62.03 49.86,62.03 50.93,61.09 50.77,60.4 49.68,61.32 49.1,61.47 49.12,60.86 49.17,60.2 49.76,60.71 50.16,60.18 50.27,61.06 47.24,57.94 46.63,56.29 50.14,52.66 48.95,53.11 50.32,46.38 40.28,45.9 45.03,45.9 35.74,46.79 37.97,45.44 41.53,43.34 48.11,43.26 34.62,55.63 35.74,54.33 37.59,54.74 63.78,60.23 62.99,57.08 62.74,52.02 62.79,49.05 65.35,52.1 65.02,58.4 64.59,68.41 64.62,65.33 64.49,63.5 51.89,68.68 52.55,71.88 57.45,72.29 45.54,70.13 44.2,67.8 31.52,71.94 34.14,69.04 36.58,69.95 43.54,81.03 42.62,87.23 44.04,91.19 43.21,84.48 42.47,76.84 45.57,84.79 50.67,85.73 50.75,80.62 56.13,84.25 58.22,82.02 64.64,78.62 64.49,76.03 64.14,73.74 63.65,83.11 62.31,87.73 62.08,90.71 61.19,94.82 64.24,92.13 64.44,87.91 60.38,85.37 52.55,99.47 52.32,97.01 51.99,93.83 55.12,98.91 61.65,101.91 61.87,106.61 61.32,99.11 62.61,111.53 65.1,111.66 52.55,109.35 43.41,109.35 34.65,109.2 40.01,109.2 48.72,109.63 4.57,111.53 2.24,111.51 2.06,107.88 8.51,109.65 13.54,109.81 3.33,103.89 4.85,107.5 5.26,101.15 4.93,91.11 5.18,85.04 10.41,90.55 3.84,80.27 18.16,96.88 18.29,101.12 19.81,102.82 22.28,106.12 31.39,102.34 38.71,100.74 44.2,102.06 42.95,98.53 37.59,96.42 33.66,96.45 28.52,95.05 31.5,99.39 30.56,91.8 31.34,84.05 32.31,76.46 23.85,83.72 24.26,81.66 24.38,93.02 17.96,94.16 17.17,88.57 16.81,81.84 24,73.13 23.65,66.98 44.04,37.11 42.65,39.42 46.53,31.24 29.77,28.45 47.78,22.41 42.06,16.13 59.59,16.61 64.21,24.56 62.71,34.8 54.51,39.45 63.6,40.39 63.35,44.81 63.02,31.24 53.92,31.7 55.3,36.6 48.29,26.98 64.9,7.95 60.83,8.94 34.77,15.6 33.78,16.64 54.28,20.42 45.8,9.38 2.9,11.99 11.81,10.37 23.11,9.32 32.05,11.33 2.82,7.75 6.1,7.98 11.43,14.86 3.89,15.17 14.45,25 13.56,28.6 9.45,17.81 19.66,13.64 17.2,12.65 8.74,43.61 9.07,47.3 8.71,52.2 9.7,49 10.08,44.35 8.38,40.03 8,45.98 8.23,49.76 14.43,48.8 14.48,47.22 14.25,45.6 14.33,44.71 14.33,43.72 14.35,42.42 8.94,58.93 8.59,62.77 8.89,60.2 9.04,57.38 4.98,67.03 3.58,70.82 7.16,70.51 7.92,64.47 8.28,81.77 33.68,47.68 46.96,35.36 51.31,33.07 44.68,41.18 38.23,47.45 23.01,28.4 23.34,39.37 23.7,44.35 23.75,40.62 22.68,40.03 10.08,42.6 33.68,56.31 34.8,52.07 46.99,50.09 48.39,50.85 52.63,49.99 57.94,53.39 57.86,51.92 57.84,56.57 57.4,59.41 41.81,57.05 44.78,57.41 32.28,70.26 23.77,68.84 35.38,67.64 24.08,60.25 22.56,60.35 10.64,56.49 40.36,16.03 31.85,64.39 26.34,96.85 26.37,105.06 43.51,105.74 38.35,105.74 32.18,105.84 30.25,109.71 54.33,44.68 39.01,34.72 34.47,37.32 34.57,33.99 34.52,40.59 34.54,28.45 30.07,31.14 30.81,34.57 28.47,38.2 27.15,38.23 23.09,42.29 23.75,46.94 13.82,34.57 11.81,25.5 13.89,30.71 6.68,25.05 3.63,24.69 1.24,24.64 5.87,19.08 1.57,5.67 63.35,6.07 52.86,12.63 54.38,17 63.53,20.42 64.47,11.97 35.48,9.17 41.86,11.41 41.45,22.28 24.38,56.44 34.34,60.07 32.59,60.07 54.46,65.15 53.01,65.13 59.21,62.26 41.25,86.41 16.97,80.27 13.79,81.66 13.77,80.17 13.84,83.8 12.52,88.32 12.37,92.76 8.46,85.3 4.04,76.18 19.58,110.42 28.22,100.99 23.09,96.78 31.65,87.38 14.12,50.14 14.1,40.69 10.79,39.83 11.91,35.49 7.65,33.43 7.65,35.77 7.67,28.25 13.21,23.12 24.56,31.04 27.48,47.68 22.45,48.57 27.36,13.57 30.96,14.61 10.31,100.36 10.34,103.71 1.47,99.95 32.05,80.27 1.5,66.96 8.38,67.06 5.49,22.33 2.08,19.26
  pour Top (isolate 0.254, rank 6): -7,126.05 -7,-13.95 75,-13.95 75,126.05
  pour Bottom (isolate 0.254, rank 6): -6,-13.95 75,-13.95 75,126.05 -6,126.05
IO0  (via drill 0.3)
  Top 0.254: FLASH.2 58.37,48.63 | 58.37,48.63 R22.1 | 58.36,48.62 58.37,48.63 | 57.71,48.76 R22.1 | Q3.3 57.84,50.2 R22.1 | v28.42,49.3 35.69,49.3 36.37,48.63 R22.1 | U1.27 24.05,49.99 v23.37,49.3
  Bottom 0.254: v23.37,49.3 v28.42,49.3
IO1  (via drill 0.3)
  Top 0.254: U1.39 8.81,55.98 v10.59,57.76 | P5.28 v10.88,78.85 v10.87,78.84
  Bottom 0.254: v10.87,78.84 10.87,58.04 v10.59,57.76
IO2/BLK  (via drill 0.3)
  Top 0.254: v22.02,56.65 R28.2 | U1.38 10.08,53.32 11.94,51.46 22.01,51.46 v22.02,51.45
  Bottom 0.254: v22.02,51.45 v22.02,56.65
IO3  (via drill 0.3)
  Top 0.254: U1.15 v30.25,39.07 | v30.28,80.34 P5.25
  Bottom 0.254: v30.28,80.34 30.28,39.09 arc-90 v30.25,39.07
IO4  (via drill 0.3)
  Top 0.254: U1.4 11.28,37.38 v11.28,38.51 | v11.28,82.86 18.14,82.86 P5.20
  Bottom 0.254: v11.28,82.86 11.48,82.65 11.48,38.71 v11.28,38.51
IO5  (via drill 0.3)
  Top 0.254: U1.5 v12.62,38.66 | P5.15 17.32,85.35 16.82,85.86 v12.01,85.86
  Bottom 0.254: v12.62,38.66 11.99,39.3 11.99,85.83 v12.01,85.86
IO6  (via drill 0.3)
  Top 0.254: U1.6 13.89,38.49 v13.16,39.22 | 12.8,85.3 12.78,85.3 | 12.78,85.3 12.78,85.27 | 12.78,85.27 12.78,85.25 v12.72,85.25 | v12.72,85.25 12.75,85.25 12.78,85.27 | 12.78,85.27 12.8,85.3 | P5.16 17.11,84.85 16.66,85.3 12.8,85.3 | 12.78,85.3 v12.72,85.25
  Bottom 0.254: v13.16,39.22 12.5,39.88 12.5,85.02 v12.72,85.25 12.52,85.04
IO7  (via drill 0.3)
  Top 0.254: U1.7 15.16,38.18 v13.31,40.03 | v13.26,84.66 16.64,84.66 16.95,84.35 P5.17
  Bottom 0.254: 13.11,40.24 v13.31,40.03 13.03,40.31 13.03,84.43 v13.26,84.66
IO8  (via drill 0.3)
  Top 0.254: U1.12 21.36,37.45 v21.36,38.51 | 18.34,80.85 P5.24 21.23,80.85 v21.36,80.98
  Bottom 0.254: v21.36,38.51 v21.36,80.98
IO9  (via drill 0.3)
  Top 0.254: U1.17 v29.06,41.61 | P5.27 28.93,79.35 v29.06,79.23
  Bottom 0.254: v29.06,79.23 v29.06,41.61
IO10/CS  (via drill 0.3)  (1 unrouted)
  Top 0.254: 46.97,17.4 46.99,17.38
  Top 0.406: v36.8,22.2 SD.2 36.8,19.59 38.02,18.37 46.53,18.37 46.96,17.94 D4.1 | v36.8,22.2 36.8,22.48 R8.1 | v36.8,42.88 U1.18 | v36.8,22.2
  Bottom 0.406: v36.8,22.2 v36.8,42.88
IO11/MOSI  (via drill 0.3)
  Top 0.254: 35.69,20.97 SD.3
  Top 0.406: R4.1 35.7,22.93 v35.7,22.38 SD.3 35.71,20.97 35.71,19.03 37.36,17.38 D4.3 | U1.19 v35.7,44.15
  Bottom 0.406: v35.7,44.15 v35.7,22.38
IO12/SCLK  (via drill 0.3)
  Top 0.406: 33.5,22.28 SD.5 33.5,18.37 37.13,14.74 45.9,14.74 46.21,15.05 D4.5 | 33.5,22.28 33.5,22.79 R5.1 | v33.48,45.42 U1.20 | v33.48,22.28 33.5,22.28
  Bottom 0.406: v33.48,22.28 v33.48,45.42
IO13/MISO  (via drill 0.3)
  Top 0.254: 31.29,20.97 SD.7
  Top 0.406: D4.6 46.96,14.55 46.33,13.92 34.92,13.92 v32.72,16.13 31.32,17.53 31.32,20.97 SD.7 31.3,23.39 arc90 R6.1 | v32.71,46.69 U1.21
  Bottom 0.406: v32.71,46.69 v32.71,16.14 v32.72,16.13
IO14  (via drill 0.3)
  Top 0.254: P5.12 v28.73,86.85 | U1.22 25.86,47.96 27.03,49.13 27.03,50.14 28.45,51.57 v28.45,52.3
  Bottom 0.254: 28.55,86.67 v28.73,86.85 28.45,86.57 v28.45,52.3
IO15  (via drill 0.3)
  Top 0.254: v15.47,84.05 15.52,84.1 16.43,84.1 16.69,83.85 18.14,83.85 | P5.18 18.14,83.85 | 18.14,83.85 | v14.91,39.75 16.43,38.23 U1.8
  Bottom 0.254: v15.47,84.05 15.24,83.82 15.24,40.62 14.91,40.29 v14.91,39.75
IO16  (via drill 0.3)
  Top 0.254: P5.19 18.14,83.34 16.2,83.34 v16.1,83.44 | v15.75,39.88 17.7,37.93 U1.9
  Bottom 0.254: v16.1,83.44 15.75,83.09 v15.75,39.88
IO17/I2C_SDA  (via drill 0.3)
  Top 0.254: U3.5 26.42,108.69 v26.42,106.89 28.53,104.78 J2.2 | U1.10 18.97,35.79 19.48,35.28 v20.62,35.28 | P2.2 20.84,30.8 v20.62,30.58 | v20.85,22.28 20.34,22.28 19.9,21.83 U8.9 19.9,18.01 R47.1
  Bottom 0.254: v26.42,106.89 20.73,101.2 20.73,35.26 | 20.73,35.26 20.73,30.56 | 20.73,30.56 20.73,22.41 v20.85,22.28 | v20.62,30.58 20.7,30.58 20.73,30.56 | v20.62,35.28 20.7,35.28 20.73,35.26
IO18/I2C_SCL  (via drill 0.3)
  Top 0.254: v25.17,107.14 U3.6 | J2.1 29.45,106.78 v29.44,106.78 | P2.3 21.16,31.3 21.15,31.3 20.24,31.3 v20.12,31.17 | U1.11 20.12,37.18 v20.12,36.07 | 20.75,19.92 20.98,20.15 20.98,21.57 20.9,21.64 20.52,21.64 20.4,21.52 U8.10 20.4,21.34 v20.57,21.52 20.68,21.52
  Top 0.406: 20.68,21.52 20.68,20.42 21.21,19.89 22.05,19.89
  Top 0.813: R42.1 21.45,19.26 R27.1 21.03,19.64 | 21.03,19.64 20.75,19.92 20.68,19.99 | 21.03,19.64 21.44,19.23 21.44,18.06
  Bottom 0.254: v29.44,106.78 28.65,107.57 25.6,107.57 v25.17,107.14 20.02,101.98 20.02,36.1 | 20.02,36.1 20.02,31.17 | 20.02,31.17 20.02,22.08 v20.57,21.52 | v20.12,36.07 20.04,36.07 20.02,36.1 | v20.12,31.17 20.02,31.17
IO19  (via drill 0.3)  (1 unrouted)
  Top 0.254: J1.1 54.81,93.04 52.68,90.91 52.68,76.81 53.59,75.9 v54.33,75.9 R20.2 | U1.13 22.78,36.25 22.96,36.07 v26.87,36.07
  Bottom 0.254: v54.33,75.9 46.58,75.9 31.45,60.76 31.45,37.42 arc-90 30.1,36.07 v26.87,36.07
IO20  (via drill 0.3)
  Top 0.254: J1.2 57.54,91.04 54.66,91.04 53.59,89.97 53.59,78.01 v54.18,77.42 R21.2 | U1.14 26.23,37.3 v26.26,37.34
  Bottom 0.254: v54.18,77.42 47.17,77.42 30.92,61.18 30.92,38.57 arc-90 29.69,37.34 v26.26,37.34
IO21  (via drill 0.3)
  Top 0.254: U1.23 25.33,49.2 25.98,49.2 26.49,49.71 26.49,50.47 27.84,51.82 v27.84,52.78 | P5.11 28.09,87.35 v28.32,87.58
  Bottom 0.254: 28.04,87.3 v28.32,87.58 27.84,87.1 v27.84,52.78
IO38/INT  (via drill 0.3)
  Top 0.254: U8.7 | U1.31 18.97,53.65 18.67,53.34 v16.36,53.34 | P2.4 16.28,31.8 v16.26,31.78 | U8.7 18.9,22.15 17.96,23.09 v16.36,23.09
  Bottom 0.254: v16.36,53.34 16.36,31.7 | v16.26,31.78 16.28,31.78 16.36,31.7 | 16.36,31.7 v16.36,23.09
IO39  (via drill 0.3)
  Top 0.254: P5.32 16.88,76.85 v16.69,76.74 | U1.32 17.7,55.6 v16.36,56.94
  Bottom 0.254: v16.36,56.94 16.36,76.41 v16.69,76.74
IO40  (via drill 0.3)
  Top 0.254: U1.33 16.43,55.41 v14.63,57.21 | P5.34 17.65,75.85 17.35,75.54 v14.64,75.54 v14.63,75.55
  Bottom 0.254: v14.63,75.55 v14.63,57.21
IO41  (via drill 0.3)
  Top 0.254: U1.34 15.16,55.68 v14.63,56.21 | P5.33 17.24,76.35 17.02,76.13 16.03,76.13 15.8,76.36 v14.25,76.36
  Bottom 0.254: v14.25,76.36 14.02,76.13 14.02,56.82 v14.63,56.21
IO42
  Top 0.254: FB1.1 13.64,67.38 13.64,54.8 U1.35
IO45  (via drill 0.3)
  Top 0.254: P5.8 19.65,88.85 26.31,88.85 v26.42,88.95 | v25.81,53.9 25.81,53.19 25.83,53.17 25.43,53.17 U1.26
  Bottom 0.254: v25.81,53.9 26.21,54.31 26.21,88.75 v26.42,88.95
IO46  (via drill 0.3)
  Top 0.254: U1.16 v29.57,40.34 | 29.6,79.8 v29.67,79.73 29.55,79.85 P5.26
  Bottom 0.254: v29.67,79.73 29.67,40.44 arc-90 v29.57,40.34
IO47  (via drill 0.3)
  Top 0.254: P5.10 27.52,87.85 v27.66,87.99 | U1.24 25.73,50.5 27.23,52 v27.23,53.24
  Bottom 0.254: 27.53,87.86 v27.66,87.99 27.23,87.56 v27.23,53.24
IO48  (via drill 0.3)
  Top 0.254: 19.65,88.34 P5.9 27,88.35 v27.13,88.47 | U1.25 26.01,51.77 26.57,52.33 v26.57,53.7
  Bottom 0.254: 27.03,88.37 v27.13,88.47 26.72,88.07 26.72,53.85 v26.57,53.7
LED+  (via drill 0.3)  (1 unrouted)
  Top 0.254: P5.2 19.65,91.85 v25.5,91.85 | 30.35,67.36 30.23,67.24 C11.2 30.1,67.36 30.33,67.36
  Top 0.61: v25.5,67.36 27.41,67.36 | 27.41,67.36 28.17,67.36 | 28.17,67.36 28.83,67.36 | 28.83,67.36 30.33,67.36 C12.2 | D1.- 28.14,67.34 28.17,67.36 | 27.41,67.36 28.12,66.65 28.83,67.36 | 26.91,57.23 27.27,57.59 | v25.5,57.23 26.92,57.23 27.25,57.56 U2.5
  Bottom 0.61: v25.5,91.85 v25.5,67.36 v25.5,57.23
LED-  (via drill 0.3)
  Top 0.254: P5.1 21.91,92.35 v22.02,92.46
  Top 0.406: v22.02,61.62 R33.2 R32.2 25.93,61.62 U2.3
  Bottom 0.254: v22.02,61.62 v22.02,92.46
N$1
  Top 0.254: IC1.16 C4.2
N$2
  Top 0.254: R26.1 Q4.1
N$3
  Top 0.254: Q3.1 52.06,52.57 R25.1
N$4
  Top 0.406: U3.1 22.63,101.37 C18.1 22.38,99.48 Q1.P$1
N$5
  Top 0.254: R50.1 R45.2 41.24,51.63 Q2.1
N$6
  Top 0.254: USB-NATIVE.A5 58.77,75.89 R15.2
N$7
  Top 0.406: PWR.C R19.2
N$8
  Top 0.61: LED1.1 R18.1
N$9
  Top 0.61: LED1.2 Q2.3
N$10
  Top 0.254: USB-TTL.A5 57.85,64.86 R13.2
N$11
  Top 0.254: USB-TTL.B5 57.24,67.86 R12.2
N$12
  Top 0.254: IC1.7 44.92,62.35 R10.1 44.81,61.93 44.96,61.93 45.36,62.33 45.64,62.33 44.73,61.42 44.73,61.24 45.82,62.33
  Top 0.61: R11.1 R10.1
N$13
  Top 0.406: U3.2 23.9,101.35 C19.1 24.13,99.45 Q1.P$2
N$14
  Top 0.254: USB-NATIVE.B5 57.28,78.89 R14.2
N$15
  Top 0.813: R24.1 9.45,106.07 Q5.3
N$16
  Top 0.61: R2.1 C15.2 C17.2
N$17  (1 unrouted)
  Top 0.254: U2.1 28.23,61.85 | 28.23,61.85 28.23,62.88 D1.+ R23.2 | 28.23,61.85 28.28,61.9 L1.P$2 | 28.32,60.76 28.5,60.76 29.03,61.29 34.7,61.29 34.7,62.51 28.8,62.51 28.4,62.92 28.4,63.3 25.86,63.3 25.86,62.64 27.69,62.64 27.99,62.33 27.99,60.76 28.32,60.76 | 28.32,60.76 28.68,61.12
  Top 0.406: 28.68,61.12 28.68,61.42 | 28.68,61.42 28.68,61.95 27.81,62.82 26.62,62.82 26.62,63.15 27.89,63.15 28.88,62.16 | 30.28,62.16 30.43,62.31 30.43,61.52 30.3,61.65 | 28.23,62.88 28.23,61.87 28.68,61.42 | 28.78,61.45 28.88,61.34
  Top 0.61: 28.88,62.16 30.28,62.16 | 30.3,61.65 28.88,61.65
N$18
  Top 0.254: IC1.21 R29.2
N$19  (via drill 0.3)
  Top 0.254: IC1.20 53.04,60.35 v53.16,60.23 | R30.2 36.69,52.6 v36.68,52.61
  Bottom 0.254: v53.16,60.23 45.54,52.61 v36.68,52.61
N$20
  Top 0.813: BT1.2 R24.2
N$22
  Top 0.254: C2.2 25.93,64.75 R23.1
N$24
  Top 0.406: R28.1 23.55,58.37 | 23.55,58.37 R31.2 | U2.4 23.82,58.65 23.55,58.37
N$25
  Top 0.254: R52.1 20.52,23.24 19.4,22.12 U8.8 19.4,19.05 R49.2
N$28  (via drill 0.3)
  Top 0.254: P5.31 14.86,77.35 v14.61,77.09 | v12.01,98.61 12.01,100.05 R3.1
  Bottom 0.254: v14.61,77.09 14.61,96.02 v12.01,98.61
N$47
  Top 0.406: SD.1 37.9,21.98 R7.1
N$48
  Top 0.406: SD.8 30.2,22.91 R9.1
RESET  (via drill 0.3)
  Top 0.254: C8.1 R16.1 10.08,35.03 U1.3 10.08,40.54 11.05,41.51 19.84,41.51 22.71,44.38 v22.71,47.05 | RST.2 Q4.3 v55.43,55.1 v55.42,55.1 | v27.76,48.7 v35,48.7
  Bottom 0.254: v55.42,55.1 49.02,48.7 v35,48.7 | v27.76,48.7 24.35,48.7 v22.71,47.05
RST  (via drill 0.3)
  Top 0.254: P2.5 v26,32.3
  Top 0.406: R44.1 C13.2 v26,17.99
  Bottom 0.406: v26,17.99 v26,32.3
RTS
  Top 0.254: IC1.19 R25.2 Q4.2
RXD/IO44  (via drill 0.3)
  Top 0.254: v28.42,50.6 v35,50.6 | 23.37,51.03 v23.37,50.6 23.37,51.84 22.53,52.68 13.28,52.68 12.62,53.34 U1.36 | R29.1 53.43,59.33 v53.42,59.31
  Bottom 0.254: v28.42,50.6 v23.37,50.6 | v53.42,59.31 44.7,50.6 v35,50.6
TXD/IO43  (via drill 0.3)  (1 unrouted)
  Top 0.254: R50.2 R30.1 36.52,49.94 v28.02,49.94 | 11.33,54.77 11.33,53.72 12.9,52.15 22.2,52.15 22.71,51.64 v22.71,49.94
  Bottom 0.254: v22.71,49.94 v28.02,49.94
USB_D+
  Top 0.254: R21.1 57.65,77.89 USB-NATIVE.B6 61.06,77.88 61.98,77.88 62.26,77.6 62.26,77.12 62.03,76.89 USB-NATIVE.A6
USB_D-
  Top 0.254: USB-NATIVE.B7 59.79,76.39 | 59.79,76.39 57.67,76.39 R20.1 | USB-NATIVE.A7 60.17,77.39 59.82,77.04 59.82,76.74 | 59.82,76.74 59.82,76.42 59.79,76.39 | 59.82,76.74 59.49,76.41 60.15,76.41 59.82,76.74
VBUS  (via drill 0.3)
  Top 0.254: v59.11,63.66 | 47.29,61.85 IC1.8 46.73,61.85 45.92,61.04 45.92,59.26 45.62,58.96 R11.2 C6.2 D2.+
  Top 0.61: USB-TTL.VBUS1 v59.11,63.66 | USB-TTL.VBUS2 v59.11,68.56 58.09,68.56 C7.2
  Bottom 0.254: 58.12,66.09 58.85,66.09 58.88,66.12
  Bottom 0.61: 59.16,65.05 58.12,66.09 59.05,67.03
  Bottom 0.813: v59.11,63.66 59.11,66.02 | 59.11,66.02 v59.11,68.56 | v46.05,60.66 46.05,64.85 47.32,66.12 58.88,66.12 59,66.12 59.11,66.02
  pour Top: 48.36,62 46.35,62 45.59,61.24 45.59,59.77 45.26,59.44 40.54,59.44 40.54,58.55 45.8,58.55 46.41,59.16 46.41,61.14 46.94,61.67 46.99,61.72 48.36,61.72
VRTC
  Top 0.61: U3.8 21.64,107.72 C14.2 C25.2 18.26,107.37 R2.2 16.9,107.35 D5.- 13.85,107.35 Q5.2
XN  (via drill 0.3)
  Top 0.254: P5.39 17.82,73.35 arc45 17.64,73.27 17.57,73.2 arc-45 17.41,73.13 v16.97,73.13 | v17.58,25.73 18.64,25.73 18.9,25.48 U8.4 | U8.4
  Bottom 0.254: v17.58,25.73 17.58,72.52 arc90 v16.97,73.13
XP  (via drill 0.3)
  Top 0.254: P5.37 17.85,74.35 arc-45 17.56,74.47 17.55,74.47 arc45 17.36,74.55 v16.97,74.55 | U8.2 19.9,26.13 19.07,26.95 v18.69,26.95
  Bottom 0.254: v16.97,74.55 17.78,74.55 arc-90 18.59,73.74 18.59,27.05 v18.69,26.95
YN  (via drill 0.3)
  Top 0.254: U8.5 17.43,24.76 v17.42,24.77 | P5.40 18.17,72.85 arc45 18.11,72.82 17.87,72.58 arc-45 17.35,72.37 v16.97,72.37
  Bottom 0.254: v16.97,72.37 16.97,25.23 v17.42,24.77
YP  (via drill 0.3)
  Top 0.254: P5.38 v16.98,73.85 v16.97,73.84 | U8.3 19.4,25.77 18.82,26.34 v18.19,26.34
  Bottom 0.254: v16.97,73.84 17.48,73.84 arc-90 18.09,73.23 18.09,26.44 v18.19,26.34

### Text on the board
tPlace: SCL | IO18 | SDA | IO17 | +3V3 | GND | + | D- | IO19 | D+ | IO20 | +3V3 | GND | - | www.makerfabs.com | with Touch 4.3" V1.1 | ESP32-S3 Parallel TFT